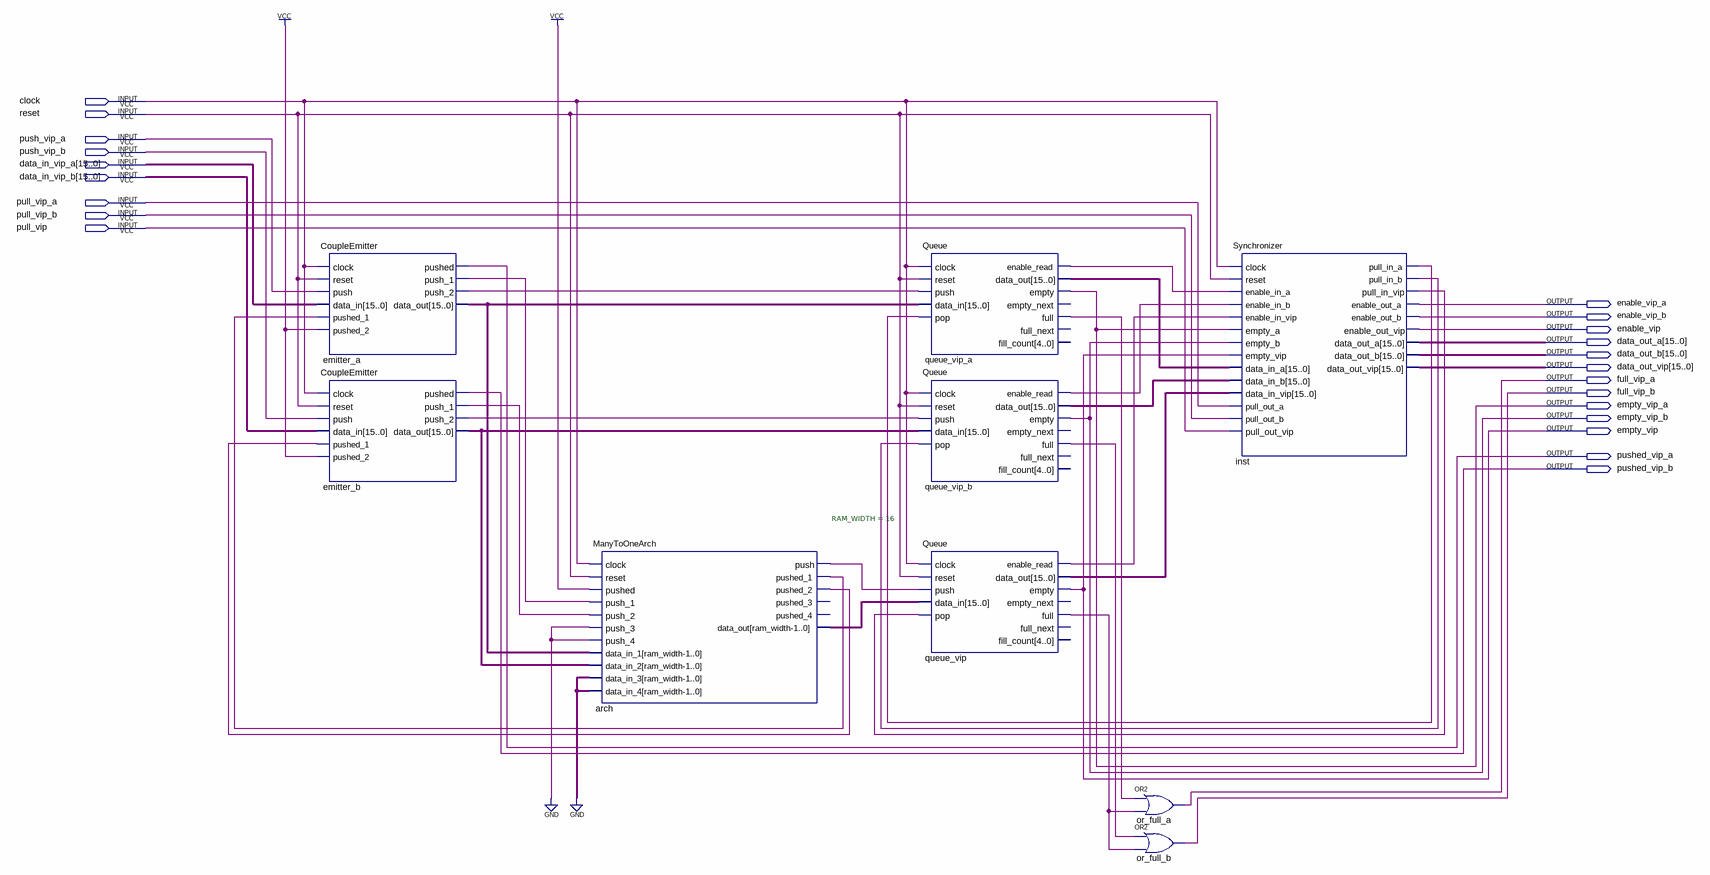
[diagram p0: schematic sheet]
// Quartus schematic TheVipQueues.bdf as structural Verilog: 9 symbols, 22 pins
module TheVipQueues (
  input  clock,
  input  reset,
  input  push_vip_a,
  input  push_vip_b,
  input  [15:0] data_in_vip_a,
  input  [15:0] data_in_vip_b,
  input  pull_vip_a,
  input  pull_vip_b,
  input  pull_vip,
  output enable_vip_a,
  output enable_vip_b,
  output enable_vip,
  output [15:0] data_out_a,
  output [15:0] data_out_b,
  output [15:0] data_out_vip,
  output full_vip_a,
  output full_vip_b,
  output empty_vip_a,
  output empty_vip_b,
  output empty_vip,
  output pushed_vip_a,
  output pushed_vip_b
);

  wire arch_push, arch_pushed_1, arch_pushed_2, emitter_a_push_1, emitter_a_push_2, emitter_b_push_1,
       emitter_b_push_2, inst_pull_in_a, inst_pull_in_b, inst_pull_in_vip, queue_vip_a_enable_read,
       queue_vip_a_full, queue_vip_b_enable_read, queue_vip_b_full, queue_vip_enable_read, queue_vip_full;
  wire [15:0] arch_data_out, emitter_a_data_out, emitter_b_data_out, queue_vip_a_data_out,
       queue_vip_b_data_out, queue_vip_data_out;

  CoupleEmitter emitter_a (
    .clock(clock), .reset(reset), .push(push_vip_a), .data_in(data_in_vip_a), .pushed_1(arch_pushed_1),
    .pushed_2(1'b1), .pushed(pushed_vip_a), .push_1(emitter_a_push_1), .push_2(emitter_a_push_2),
    .data_out(emitter_a_data_out));
  CoupleEmitter emitter_b (
    .clock(clock), .reset(reset), .push(push_vip_b), .data_in(data_in_vip_b), .pushed_1(arch_pushed_2),
    .pushed_2(1'b1), .pushed(pushed_vip_b), .push_1(emitter_b_push_1), .push_2(emitter_b_push_2),
    .data_out(emitter_b_data_out));
  ManyToOneArch #(.RAM_WIDTH(16)) arch (
    .clock(clock), .reset(reset), .pushed(1'b1), .push_1(emitter_a_push_1), .push_2(emitter_b_push_1),
    .push_3(1'b0), .push_4(1'b0), .data_in_1(emitter_a_data_out), .data_in_2(emitter_b_data_out),
    .data_in_3({16{1'b0}}), .data_in_4({16{1'b0}}), .push(arch_push), .pushed_1(arch_pushed_1),
    .pushed_2(arch_pushed_2), .data_out(arch_data_out));  // open: pushed_3, pushed_4
  Queue queue_vip_a (
    .clock(clock), .reset(reset), .push(emitter_a_push_2), .data_in(emitter_a_data_out),
    .pop(inst_pull_in_a), .enable_read(queue_vip_a_enable_read), .data_out(queue_vip_a_data_out),
    .empty(empty_vip_a), .full(queue_vip_a_full));  // open: empty_next, full_next, fill_count
  Queue queue_vip_b (
    .clock(clock), .reset(reset), .push(emitter_b_push_2), .data_in(emitter_b_data_out),
    .pop(inst_pull_in_b), .enable_read(queue_vip_b_enable_read), .data_out(queue_vip_b_data_out),
    .empty(empty_vip_b), .full(queue_vip_b_full));  // open: empty_next, full_next, fill_count
  Queue queue_vip (
    .clock(clock), .reset(reset), .push(arch_push), .data_in(arch_data_out), .pop(inst_pull_in_vip),
    .enable_read(queue_vip_enable_read), .data_out(queue_vip_data_out), .empty(empty_vip),
    .full(queue_vip_full));  // open: empty_next, full_next, fill_count
  or or_full_a (full_vip_a, queue_vip_a_full, queue_vip_full);
  or or_full_b (full_vip_b, queue_vip_b_full, queue_vip_full);
  Synchronizer inst (
    .clock(clock), .reset(reset), .enable_in_a(queue_vip_a_enable_read),
    .enable_in_b(queue_vip_b_enable_read), .enable_in_vip(queue_vip_enable_read), .empty_a(empty_vip_a),
    .empty_b(empty_vip_b), .empty_vip(empty_vip), .data_in_a(queue_vip_a_data_out),
    .data_in_b(queue_vip_b_data_out), .data_in_vip(queue_vip_data_out), .pull_out_a(pull_vip_a),
    .pull_out_b(pull_vip_b), .pull_out_vip(pull_vip), .pull_in_a(inst_pull_in_a), .pull_in_b(inst_pull_in_b),
    .pull_in_vip(inst_pull_in_vip), .enable_out_a(enable_vip_a), .enable_out_b(enable_vip_b),
    .enable_out_vip(enable_vip), .data_out_a(data_out_a), .data_out_b(data_out_b), .data_out_vip(data_out_vip));
endmodule
